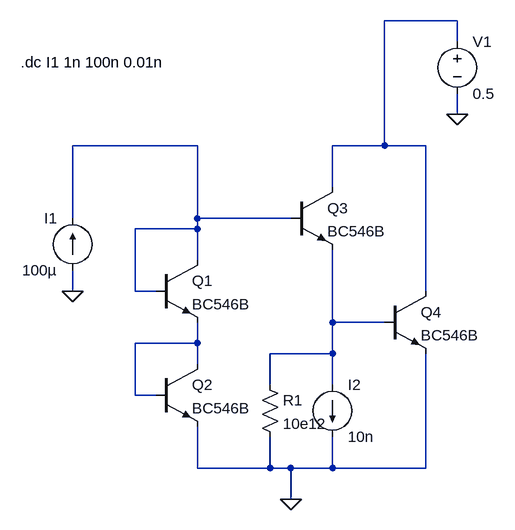
[diagram p0: schematic square vector sqrt w  ideal current sources.asc]
square vector sqrt w  ideal current sources.asc, the LTspice schematic file:
Version 4
SHEET 1 880 680
WIRE 624 -240 512 -240
WIRE 624 -208 624 -240
WIRE 624 -96 624 -128
WIRE 224 -48 32 -48
WIRE 512 -48 512 -240
WIRE 512 -48 432 -48
WIRE 576 -48 512 -48
WIRE 432 16 432 -48
WIRE 32 64 32 -48
WIRE 224 64 224 -48
WIRE 368 64 224 64
WIRE 224 80 224 64
WIRE 224 80 128 80
WIRE 224 128 224 80
WIRE 32 176 32 144
WIRE 128 176 128 80
WIRE 160 176 128 176
WIRE 576 176 576 -48
WIRE 432 224 432 112
WIRE 512 224 432 224
WIRE 224 256 224 224
WIRE 224 256 128 256
WIRE 432 272 432 224
WIRE 432 272 336 272
WIRE 224 288 224 256
WIRE 336 320 336 272
WIRE 432 320 432 272
WIRE 128 336 128 256
WIRE 160 336 128 336
WIRE 224 448 224 384
WIRE 336 448 336 400
WIRE 336 448 224 448
WIRE 368 448 336 448
WIRE 432 448 432 400
WIRE 432 448 368 448
WIRE 576 448 576 272
WIRE 576 448 432 448
WIRE 368 496 368 448
FLAG 32 176 0
FLAG 624 -96 0
FLAG 368 496 0
SYMBOL current 32 144 R180
WINDOW 0 24 80 Left 2
WINDOW 3 24 0 Left 2
WINDOW 123 0 0 Left 0
WINDOW 39 0 0 Left 0
SYMATTR InstName I1
SYMATTR Value 100µ
SYMBOL npn 160 128 R0
SYMATTR InstName Q1
SYMATTR Value BC546B
SYMBOL npn 160 288 R0
SYMATTR InstName Q2
SYMATTR Value BC546B
SYMBOL npn 368 16 R0
SYMATTR InstName Q3
SYMATTR Value BC546B
SYMBOL npn 512 176 R0
SYMATTR InstName Q4
SYMATTR Value BC546B
SYMBOL voltage 624 -224 R0
WINDOW 123 0 0 Left 0
WINDOW 39 0 0 Left 0
SYMATTR InstName V1
SYMATTR Value 0.5
SYMBOL current 432 320 R0
WINDOW 123 0 0 Left 0
WINDOW 39 0 0 Left 0
SYMATTR InstName I2
SYMATTR Value 10n
SYMBOL res 320 304 R0
SYMATTR InstName R1
SYMATTR Value 10e12
TEXT -48 -176 Left 2 !.dc I1 1n 100n 0.01n

The netlist it stands for:
* square vector sqrt w  ideal current sources.asc
I1 0 N002 100µ
Q1 N002 N002 N004 0 BC546B
Q2 N004 N004 0 0 BC546B
Q3 N001 N002 N003 0 BC546B
Q4 N001 N003 0 0 BC546B
V1 N001 0 0.5
I2 N003 0 10n
R1 N003 0 10e12
.model NPN NPN
.model PNP PNP
.lib standard.bjt
.dc I1 1n 100n 0.01n
.backanno
.end